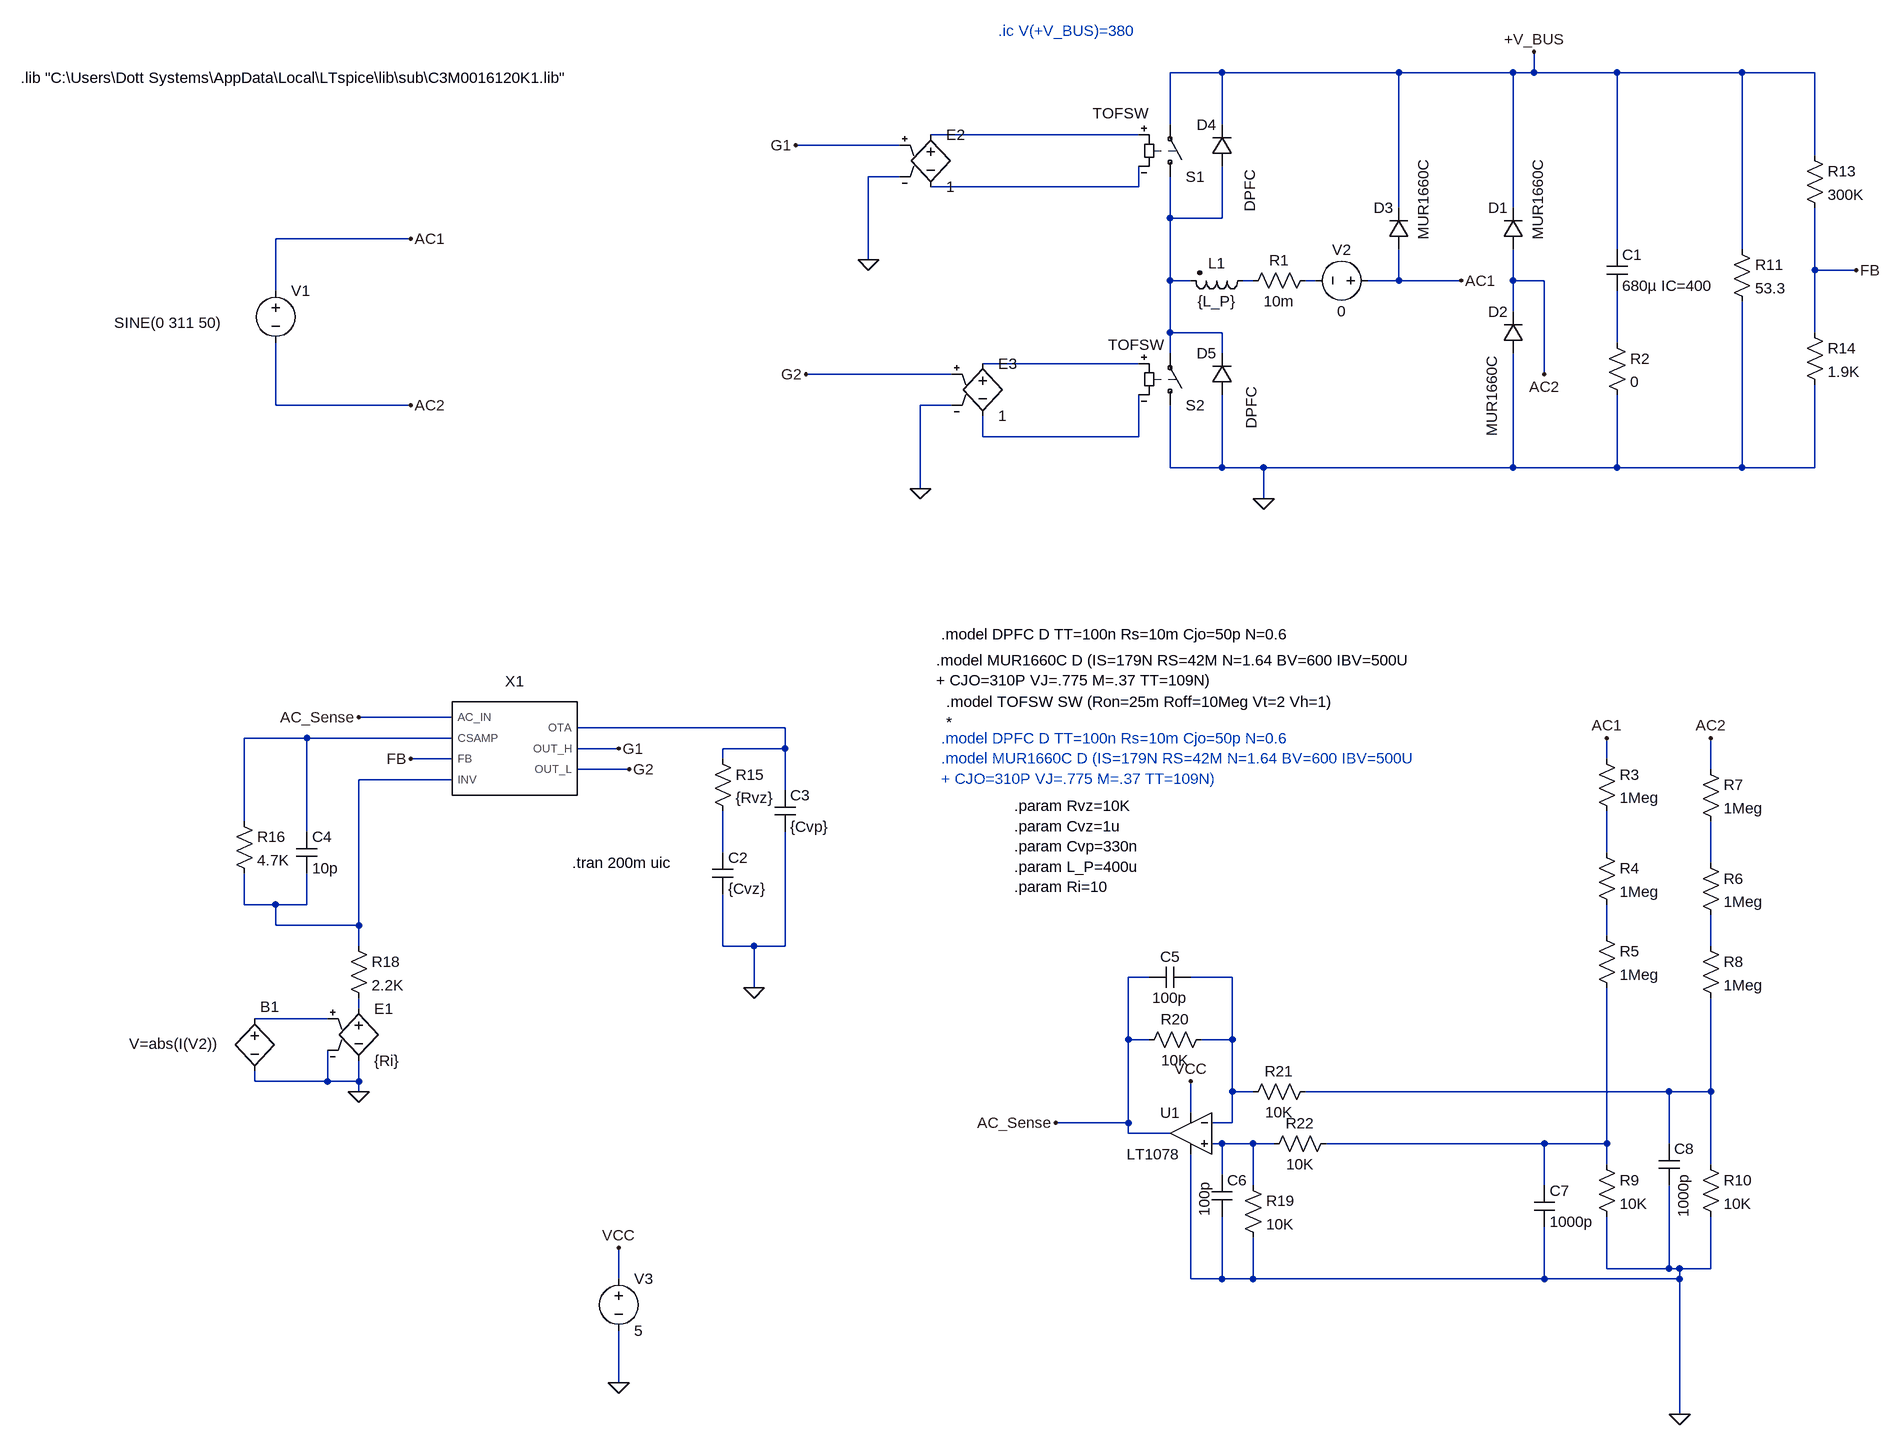
[diagram p0: schematic totempole_pfc.asc]
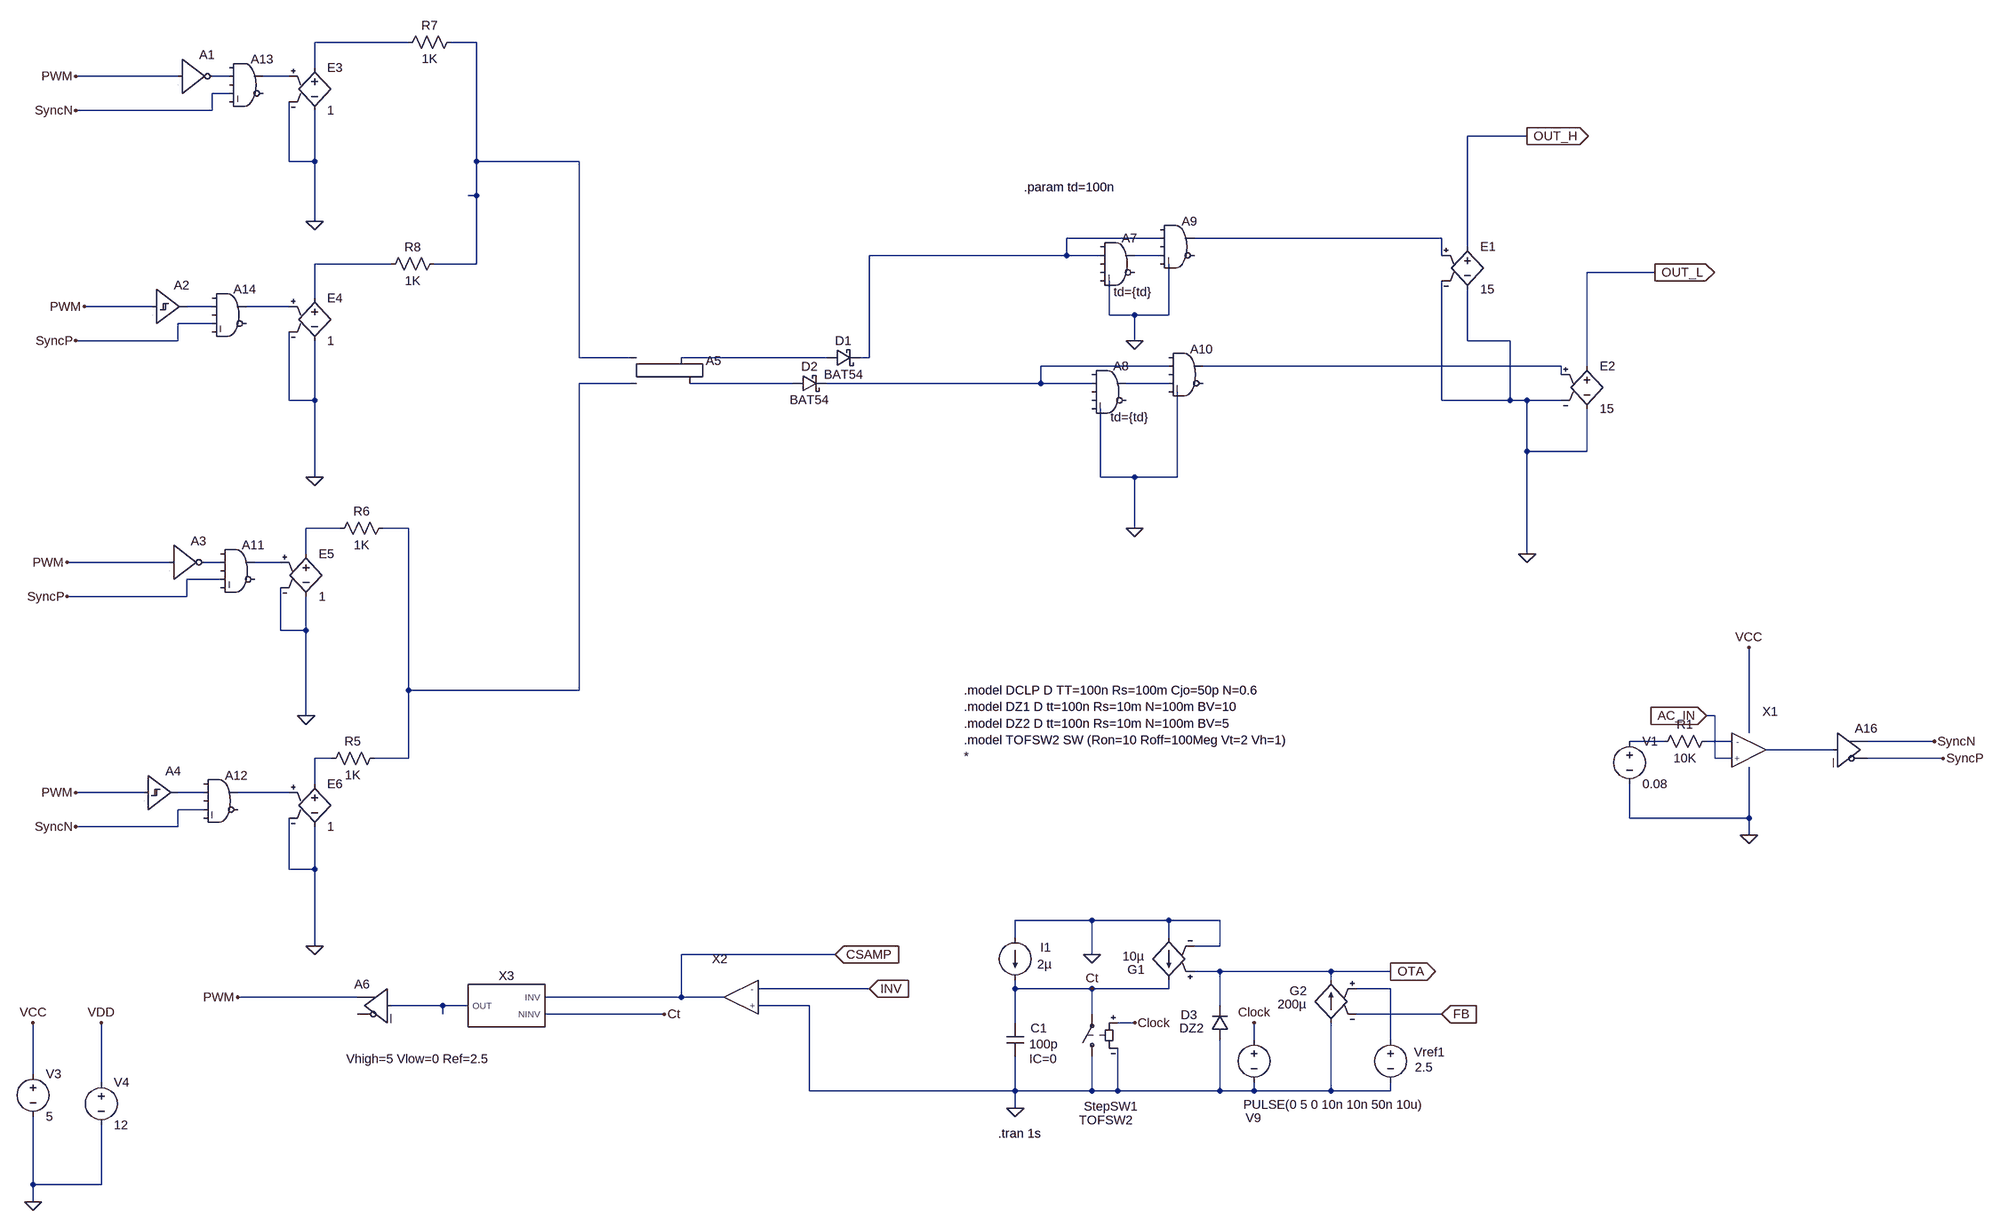
[diagram p1: sub-circuit drive.asc]
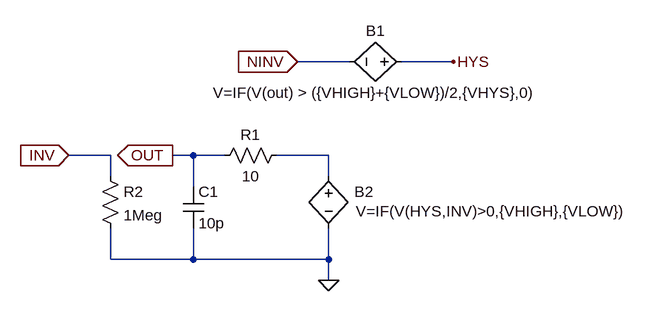
[diagram p2: sub-circuit ompamp.asc]
totempole_pfc.asc, the LTspice schematic file:
Version 4
SHEET 1 2784 2188
WIRE 976 -112 896 -112
WIRE 1248 -112 976 -112
WIRE 1424 -112 1248 -112
WIRE 1456 -112 1456 -144
WIRE 1456 -112 1424 -112
WIRE 1584 -112 1456 -112
WIRE 1776 -112 1584 -112
WIRE 1888 -112 1776 -112
WIRE 896 -32 896 -112
WIRE 976 -32 976 -112
WIRE 848 -16 528 -16
WIRE 480 0 320 0
WIRE 1888 16 1888 -112
WIRE 480 48 432 48
WIRE 848 64 848 32
WIRE 848 64 528 64
WIRE 1248 96 1248 -112
WIRE 1424 96 1424 -112
WIRE 896 112 896 48
WIRE 976 112 976 32
WIRE 976 112 896 112
WIRE -272 144 -480 144
WIRE 1584 160 1584 -112
WIRE 1776 160 1776 -112
WIRE 432 176 432 48
WIRE 1888 192 1888 96
WIRE 1952 192 1888 192
WIRE 896 208 896 112
WIRE 928 208 896 208
WIRE 1024 208 1008 208
WIRE 1120 208 1104 208
WIRE 1248 208 1248 160
WIRE 1248 208 1200 208
WIRE 1344 208 1248 208
WIRE 1424 208 1424 160
WIRE 1472 208 1424 208
WIRE -480 224 -480 144
WIRE 1424 256 1424 208
WIRE 896 288 896 208
WIRE 976 288 896 288
WIRE 1888 288 1888 192
WIRE 1584 304 1584 224
WIRE 896 320 896 288
WIRE 976 320 976 288
WIRE 848 336 608 336
WIRE 560 352 336 352
WIRE 1472 352 1472 208
WIRE -480 400 -480 304
WIRE -272 400 -480 400
WIRE 560 400 512 400
WIRE 608 448 608 416
WIRE 848 448 848 384
WIRE 848 448 608 448
WIRE 896 496 896 400
WIRE 976 496 976 384
WIRE 976 496 896 496
WIRE 1040 496 976 496
WIRE 1424 496 1424 320
WIRE 1424 496 1040 496
WIRE 1584 496 1584 384
WIRE 1584 496 1424 496
WIRE 1776 496 1776 240
WIRE 1776 496 1584 496
WIRE 1888 496 1888 368
WIRE 1888 496 1776 496
WIRE 512 528 512 400
WIRE 1040 544 1040 496
WIRE -208 880 -352 880
WIRE 304 896 -16 896
WIRE -432 912 -528 912
WIRE -208 912 -432 912
WIRE 48 928 -16 928
WIRE 304 928 304 896
WIRE 304 928 208 928
WIRE -208 944 -272 944
WIRE 208 944 208 928
WIRE 1568 944 1568 912
WIRE 64 960 -16 960
WIRE 1728 960 1728 912
WIRE -208 976 -352 976
WIRE 304 992 304 928
WIRE -528 1040 -528 912
WIRE -432 1056 -432 912
WIRE 208 1088 208 1024
WIRE 1568 1088 1568 1024
WIRE 1728 1104 1728 1040
WIRE -528 1168 -528 1120
WIRE -480 1168 -528 1168
WIRE -432 1168 -432 1120
WIRE -432 1168 -480 1168
WIRE -480 1200 -480 1168
WIRE -352 1200 -352 976
WIRE -352 1200 -480 1200
WIRE 1568 1216 1568 1168
WIRE -352 1232 -352 1200
WIRE 208 1232 208 1152
WIRE 256 1232 208 1232
WIRE 304 1232 304 1056
WIRE 304 1232 256 1232
WIRE 1728 1232 1728 1184
WIRE 864 1280 832 1280
WIRE 992 1280 928 1280
WIRE 256 1296 256 1232
WIRE -352 1328 -352 1312
WIRE -400 1344 -512 1344
WIRE 832 1376 832 1280
WIRE 864 1376 832 1376
WIRE 992 1376 992 1280
WIRE 992 1376 944 1376
WIRE -512 1440 -512 1424
WIRE -400 1440 -400 1392
WIRE -400 1440 -512 1440
WIRE -352 1440 -352 1408
WIRE -352 1440 -400 1440
WIRE -352 1456 -352 1440
WIRE 992 1456 992 1376
WIRE 1024 1456 992 1456
WIRE 1664 1456 1104 1456
WIRE 1728 1456 1728 1312
WIRE 1728 1456 1664 1456
WIRE 928 1488 928 1440
WIRE 832 1504 832 1376
WIRE 832 1504 720 1504
WIRE 992 1504 992 1456
WIRE 992 1504 960 1504
WIRE 832 1520 832 1504
WIRE 896 1520 832 1520
WIRE 976 1536 960 1536
WIRE 1024 1536 976 1536
WIRE 1056 1536 1024 1536
WIRE 1472 1536 1136 1536
WIRE 1568 1536 1568 1296
WIRE 1568 1536 1472 1536
WIRE 1664 1536 1664 1456
WIRE 1568 1568 1568 1536
WIRE 1728 1568 1728 1456
WIRE 976 1584 976 1536
WIRE 1024 1600 1024 1536
WIRE 1472 1600 1472 1536
WIRE 1568 1728 1568 1648
WIRE 1664 1728 1664 1600
WIRE 1664 1728 1568 1728
WIRE 1680 1728 1664 1728
WIRE 1728 1728 1728 1648
WIRE 1728 1728 1680 1728
WIRE 48 1744 48 1696
WIRE 928 1744 928 1552
WIRE 976 1744 976 1648
WIRE 976 1744 928 1744
WIRE 1024 1744 1024 1680
WIRE 1024 1744 976 1744
WIRE 1472 1744 1472 1664
WIRE 1472 1744 1024 1744
WIRE 1680 1744 1680 1728
WIRE 1680 1744 1472 1744
WIRE 48 1904 48 1824
WIRE 1680 1952 1680 1744
FLAG 1040 544 0
FLAG -272 144 AC1
FLAG -272 400 AC2
FLAG 1344 208 AC1
FLAG 1472 352 AC2
FLAG 1456 -144 +V_BUS
FLAG -352 880 AC_Sense
FLAG 48 928 G1
FLAG 64 960 G2
FLAG -272 944 FB
FLAG 256 1296 0
FLAG -352 1456 0
FLAG 1952 192 FB
FLAG 432 176 0
FLAG 512 528 0
FLAG 336 352 G2
FLAG 320 0 G1
FLAG 1568 912 AC1
FLAG 1728 912 AC2
FLAG 1680 1952 0
FLAG 720 1504 AC_Sense
FLAG 48 1696 VCC
FLAG 928 1440 VCC
FLAG 48 1904 0
SYMBOL voltage -480 208 R0
WINDOW 3 -248 65 Left 2
WINDOW 123 0 0 Left 0
WINDOW 39 0 0 Left 0
SYMATTR Value SINE(0 311 50)
SYMATTR InstName V1
SYMBOL ind2 1024 192 R90
WINDOW 0 5 56 VBottom 2
WINDOW 3 32 56 VTop 2
SYMATTR InstName L1
SYMATTR Value {L_P}
SYMATTR Type ind
SYMBOL res 1760 144 R0
SYMATTR InstName R11
SYMATTR Value 53.3
SYMBOL cap 1568 160 R0
SYMATTR InstName C1
SYMATTR Value 680µ IC=400
SYMATTR SpiceLine V=650
SYMBOL res 1872 0 R0
SYMATTR InstName R13
SYMATTR Value 300K
SYMBOL res 1872 272 R0
SYMATTR InstName R14
SYMATTR Value 1.9K
SYMBOL res 192 928 R0
SYMATTR InstName R15
SYMATTR Value {Rvz}
SYMBOL cap 192 1088 R0
SYMATTR InstName C2
SYMATTR Value {Cvz}
SYMBOL cap 288 992 R0
SYMATTR InstName C3
SYMATTR Value {Cvp}
SYMBOL res -544 1024 R0
SYMATTR InstName R16
SYMATTR Value 4.7K
SYMBOL cap -448 1056 R0
SYMATTR InstName C4
SYMATTR Value 10p
SYMBOL e -352 1312 R0
SYMATTR InstName E1
SYMATTR Value {Ri}
SYMBOL res -368 1216 R0
SYMATTR InstName R18
SYMATTR Value 2.2K
SYMBOL voltage 1216 208 R90
WINDOW 0 -32 56 VBottom 2
WINDOW 3 32 56 VTop 2
SYMATTR InstName V2
SYMATTR Value 0
SYMBOL bv -512 1328 R0
WINDOW 3 -193 54 Left 2
WINDOW 0 8 -3 Left 2
SYMATTR Value V=abs(I(V2))
SYMATTR InstName B1
SYMBOL diode 1440 160 R180
WINDOW 0 24 64 Left 2
WINDOW 3 -22 14 VRight 2
SYMATTR InstName D1
SYMATTR Value MUR1660C
SYMBOL diode 1440 320 R180
WINDOW 0 24 64 Left 2
WINDOW 3 49 -128 VRight 2
SYMATTR InstName D2
SYMATTR Value MUR1660C
SYMBOL res 1120 192 R90
WINDOW 0 0 56 VBottom 2
WINDOW 3 32 56 VTop 2
SYMATTR InstName R1
SYMATTR Value 10m
SYMBOL e 528 -32 R0
SYMATTR InstName E2
SYMATTR Value 1
SYMBOL e 608 320 R0
SYMATTR InstName E3
SYMATTR Value 1
SYMBOL res 1568 288 R0
SYMATTR InstName R2
SYMATTR Value 0
SYMBOL diode 1264 160 R180
WINDOW 0 24 64 Left 2
WINDOW 3 -22 14 VRight 2
SYMATTR InstName D3
SYMATTR Value MUR1660C
SYMBOL sw 896 64 M180
WINDOW 3 -119 113 Left 2
SYMATTR Value TOFSW
SYMATTR InstName S1
SYMBOL sw 896 416 M180
WINDOW 3 -95 109 Left 2
SYMATTR Value TOFSW
SYMATTR InstName S2
SYMBOL diode 992 32 R180
WINDOW 0 24 64 Left 2
WINDOW 3 -27 -71 VRight 2
SYMATTR InstName D4
SYMATTR Value DPFC
SYMBOL diode 992 384 R180
WINDOW 0 24 64 Left 2
WINDOW 3 -29 -53 VRight 2
SYMATTR InstName D5
SYMATTR Value DPFC
SYMBOL res 1552 928 R0
SYMATTR InstName R3
SYMATTR Value 1Meg
SYMBOL res 1552 1072 R0
SYMATTR InstName R4
SYMATTR Value 1Meg
SYMBOL res 1552 1200 R0
SYMATTR InstName R5
SYMATTR Value 1Meg
SYMBOL res 1712 1088 R0
SYMATTR InstName R6
SYMATTR Value 1Meg
SYMBOL res 1712 944 R0
SYMATTR InstName R7
SYMATTR Value 1Meg
SYMBOL res 1712 1216 R0
SYMATTR InstName R8
SYMATTR Value 1Meg
SYMBOL res 1552 1552 R0
SYMATTR InstName R9
SYMATTR Value 10K
SYMBOL res 1712 1552 R0
SYMATTR InstName R10
SYMATTR Value 10K
SYMBOL drive -112 928 R0
WINDOW 0 0 -88 Bottom 2
SYMATTR InstName X1
SYMBOL OpAmps\\LT1078 928 1456 M0
SYMATTR InstName U1
SYMBOL res 960 1360 R90
WINDOW 0 0 56 VBottom 2
WINDOW 3 32 56 VTop 2
SYMATTR InstName R20
SYMATTR Value 10K
SYMBOL voltage 48 1728 R0
WINDOW 123 0 0 Left 0
WINDOW 39 0 0 Left 0
SYMATTR InstName V3
SYMATTR Value 5
SYMBOL cap 928 1264 R90
WINDOW 0 0 32 VBottom 2
WINDOW 3 32 32 VTop 2
SYMATTR InstName C5
SYMATTR Value 100p
SYMBOL res 1008 1584 R0
SYMATTR InstName R19
SYMATTR Value 10K
SYMBOL res 1120 1440 R90
WINDOW 0 0 56 VBottom 2
WINDOW 3 32 56 VTop 2
SYMATTR InstName R21
SYMATTR Value 10K
SYMBOL res 1152 1520 R90
WINDOW 0 0 56 VBottom 2
WINDOW 3 32 56 VTop 2
SYMATTR InstName R22
SYMATTR Value 10K
SYMBOL cap 960 1584 R0
WINDOW 3 -11 10 VRight 2
SYMATTR Value 100p
SYMATTR InstName C6
SYMBOL cap 1456 1600 R0
SYMATTR InstName C7
SYMATTR Value 1000p
SYMBOL cap 1648 1536 R0
WINDOW 3 38 46 VRight 2
SYMATTR InstName C8
SYMATTR Value 1000p
TEXT -24 1104 Left 2 !.tran 200m uic
TEXT 656 1016 Left 2 !.param Rvz=10K\n.param Cvz=1u\n.param Cvp=330n\n.param L_P=400u\n.param Ri=10
TEXT 552 856 Left 2 !.model TOFSW SW (Ron=25m Roff=10Meg Vt=2 Vh=1)\n*
TEXT 544 912 Left 2 ;.model DPFC D TT=100n Rs=10m Cjo=50p N=0.6\n.model MUR1660C D (IS=179N RS=42M N=1.64 BV=600 IBV=500U\n+ CJO=310P VJ=.775 M=.37 TT=109N)
TEXT 632 -176 Left 2 ;.ic V(+V_BUS)=380
TEXT -872 -104 Left 2 !.lib "C:\\Users\\Dott Systems\\AppData\\Local\\LTspice\\lib\\sub\\C3M0016120K1.lib"
TEXT 536 792 Left 2 !.model MUR1660C D (IS=179N RS=42M N=1.64 BV=600 IBV=500U\n+ CJO=310P VJ=.775 M=.37 TT=109N)
TEXT 544 752 Left 2 !.model DPFC D TT=100n Rs=10m Cjo=50p N=0.6

drive.asc, the sub-circuit schematic file:
Version 4
SHEET 1 3092 1588
WIRE -640 -608 -816 -608
WIRE -512 -608 -560 -608
WIRE -816 -560 -816 -608
WIRE -1072 -544 -1264 -544
WIRE -976 -544 -1008 -544
WIRE -864 -544 -912 -544
WIRE -976 -512 -1008 -512
WIRE -1008 -480 -1008 -512
WIRE -1008 -480 -1264 -480
WIRE 1488 -432 1376 -432
WIRE -864 -384 -864 -496
WIRE -816 -384 -816 -480
WIRE -816 -384 -864 -384
WIRE -512 -384 -512 -608
WIRE -320 -384 -512 -384
WIRE -512 -320 -512 -384
WIRE -512 -320 -528 -320
WIRE -816 -272 -816 -384
WIRE 800 -240 624 -240
WIRE 1328 -240 864 -240
WIRE 1376 -224 1376 -432
WIRE 624 -208 624 -240
WIRE 624 -208 224 -208
WIRE 688 -208 624 -208
WIRE 800 -208 752 -208
WIRE 1328 -208 1328 -240
WIRE -672 -192 -816 -192
WIRE -512 -192 -512 -320
WIRE -512 -192 -592 -192
WIRE 1728 -176 1600 -176
WIRE -816 -128 -816 -192
WIRE -1120 -112 -1248 -112
WIRE -1008 -112 -1056 -112
WIRE -864 -112 -944 -112
WIRE 704 -96 704 -160
WIRE 752 -96 704 -96
WIRE 816 -96 816 -192
WIRE 816 -96 752 -96
WIRE -1008 -80 -1072 -80
WIRE -1072 -48 -1072 -80
WIRE -1072 -48 -1264 -48
WIRE 752 -48 752 -96
WIRE 1376 -48 1376 -144
WIRE 1456 -48 1376 -48
WIRE -320 -16 -320 -384
WIRE -224 -16 -320 -16
WIRE 144 -16 -128 -16
WIRE 224 -16 224 -208
WIRE 224 -16 208 -16
WIRE 816 0 576 0
WIRE 1552 0 880 0
WIRE 1600 0 1600 -176
WIRE 1552 16 1552 0
WIRE -224 32 -320 32
WIRE 80 32 -112 32
WIRE 576 32 576 0
WIRE 576 32 144 32
WIRE 672 32 576 32
WIRE 816 32 736 32
WIRE -864 64 -864 -64
WIRE -816 64 -816 -48
WIRE -816 64 -864 64
WIRE 1328 64 1328 -160
WIRE 1456 64 1456 -48
WIRE 1456 64 1328 64
WIRE 1488 64 1456 64
WIRE 1552 64 1488 64
WIRE 1488 160 1488 64
WIRE 1600 160 1600 80
WIRE 1600 160 1488 160
WIRE -816 208 -816 64
WIRE 688 208 688 80
WIRE 752 208 688 208
WIRE 832 208 832 48
WIRE 832 208 752 208
WIRE -768 304 -832 304
WIRE -640 304 -688 304
WIRE 752 304 752 208
WIRE -832 352 -832 304
WIRE 1488 352 1488 160
WIRE -1088 368 -1280 368
WIRE -992 368 -1024 368
WIRE -880 368 -928 368
WIRE -992 400 -1056 400
WIRE -1056 432 -1056 400
WIRE -1056 432 -1280 432
WIRE -880 496 -880 416
WIRE -832 496 -832 432
WIRE -832 496 -880 496
WIRE -640 608 -640 304
WIRE -320 608 -320 32
WIRE -320 608 -640 608
WIRE -832 656 -832 496
WIRE 1840 656 1824 656
WIRE 1904 688 1904 528
WIRE 1744 704 1680 704
WIRE 1872 704 1824 704
WIRE 2272 704 2128 704
WIRE 2064 720 1936 720
WIRE -784 736 -816 736
WIRE -640 736 -640 608
WIRE -640 736 -704 736
WIRE 1840 736 1840 656
WIRE 1872 736 1840 736
WIRE 2288 736 2128 736
WIRE -816 784 -816 736
WIRE -1136 800 -1264 800
WIRE -1024 800 -1072 800
WIRE -864 800 -960 800
WIRE -1024 832 -1072 832
WIRE 1680 848 1680 784
WIRE 1904 848 1904 752
WIRE 1904 848 1680 848
WIRE -1072 864 -1072 832
WIRE -1072 864 -1264 864
WIRE 1904 880 1904 848
WIRE -864 944 -864 848
WIRE -816 944 -816 864
WIRE -816 944 -864 944
WIRE 672 1040 528 1040
WIRE 816 1040 672 1040
WIRE 912 1040 816 1040
WIRE 528 1072 528 1040
WIRE 816 1072 816 1040
WIRE -816 1088 -816 944
WIRE 912 1088 912 1040
WIRE 912 1088 864 1088
WIRE 160 1104 -128 1104
WIRE 672 1104 672 1040
WIRE 912 1136 864 1136
WIRE 1120 1136 912 1136
WIRE 1232 1136 1120 1136
WIRE 1120 1152 1120 1136
WIRE 224 1168 16 1168
WIRE 528 1168 528 1152
WIRE 672 1168 528 1168
WIRE 816 1168 816 1152
WIRE 816 1168 672 1168
WIRE 1232 1168 1168 1168
WIRE -736 1184 -960 1184
WIRE -128 1184 -128 1104
WIRE -128 1184 -384 1184
WIRE -48 1184 -128 1184
WIRE -576 1200 -672 1200
WIRE -528 1200 -576 1200
WIRE 112 1200 16 1200
WIRE 912 1200 912 1136
WIRE -576 1216 -576 1200
WIRE -160 1216 -384 1216
WIRE 672 1216 672 1168
WIRE 1328 1216 1168 1216
WIRE 528 1232 528 1168
WIRE 752 1232 720 1232
WIRE 976 1264 976 1232
WIRE 1232 1264 1232 1168
WIRE -1344 1328 -1344 1232
WIRE -1216 1344 -1216 1232
WIRE 112 1360 112 1200
WIRE 528 1360 528 1296
WIRE 528 1360 112 1360
WIRE 672 1360 672 1296
WIRE 672 1360 528 1360
WIRE 720 1360 720 1280
WIRE 720 1360 672 1360
WIRE 912 1360 912 1264
WIRE 912 1360 720 1360
WIRE 976 1360 976 1344
WIRE 976 1360 912 1360
WIRE 1120 1360 1120 1232
WIRE 1120 1360 976 1360
WIRE 1232 1360 1232 1344
WIRE 1232 1360 1120 1360
WIRE 528 1392 528 1360
WIRE -1344 1536 -1344 1408
WIRE -1216 1536 -1216 1424
WIRE -1216 1536 -1344 1536
WIRE -1344 1568 -1344 1536
FLAG -1344 1568 0
FLAG -1344 1232 VCC
FLAG -1216 1232 VDD
FLAG -1248 -112 PWM
FLAG -1264 -544 PWM
FLAG -816 -272 0
FLAG -1264 800 PWM
FLAG -1280 368 PWM
FLAG -816 208 0
FLAG -832 656 0
FLAG -816 1088 0
FLAG 1488 352 0
FLAG 1824 656 AC_IN
IOPIN 1824 656 In
FLAG 1488 -432 OUT_H
IOPIN 1488 -432 Out
FLAG 1728 -176 OUT_L
IOPIN 1728 -176 Out
FLAG 672 1104 0
FLAG 672 1168 Ct
FLAG 528 1392 0
FLAG 1328 1216 FB
IOPIN 1328 1216 In
FLAG 1232 1136 OTA
IOPIN 1232 1136 Out
FLAG 752 1232 Clock
FLAG 976 1232 Clock
FLAG 224 1168 INV
IOPIN 224 1168 In
FLAG 160 1104 CSAMP
IOPIN 160 1104 In
FLAG -960 1184 PWM
FLAG -160 1216 Ct
FLAG 752 -48 0
FLAG 752 304 0
FLAG -1280 432 SyncP
FLAG -1264 864 SyncN
FLAG -1264 -48 SyncP
FLAG -1264 -480 SyncN
FLAG 2272 704 SyncN
FLAG 1904 880 0
FLAG 1904 528 VCC
FLAG 2288 736 SyncP
SYMBOL voltage -1344 1312 R0
WINDOW 123 0 0 Left 0
WINDOW 39 0 0 Left 0
SYMATTR InstName V3
SYMATTR Value 5
SYMBOL voltage -1216 1328 R0
WINDOW 123 0 0 Left 0
WINDOW 39 0 0 Left 0
SYMATTR InstName V4
SYMATTR Value 12
SYMBOL Digital\\inv -1072 -608 R0
SYMATTR InstName A1
SYMBOL Digital\\schmtbuf -1120 -176 R0
SYMATTR InstName A2
SYMBOL Digital\\inv -1088 304 R0
SYMATTR InstName A3
SYMBOL Digital\\schmtbuf -1136 736 R0
SYMATTR InstName A4
SYMBOL schottky 144 -32 M90
WINDOW 0 0 32 VBottom 2
WINDOW 3 32 32 VTop 2
SYMATTR InstName D1
SYMATTR Value BAT54
SYMATTR Description Diode
SYMATTR Type diode
SYMBOL schottky 80 16 M90
WINDOW 0 0 32 VBottom 2
WINDOW 3 32 32 VTop 2
SYMATTR InstName D2
SYMATTR Value BAT54
SYMATTR Description Diode
SYMATTR Type diode
SYMBOL Digital\\srflop -176 -64 R0
SYMATTR InstName A5
SYMBOL e 1376 -240 R0
SYMATTR InstName E1
SYMATTR Value 15
SYMBOL e 1600 -16 R0
SYMATTR InstName E2
SYMATTR Value 15
SYMBOL current 528 1072 R0
WINDOW 0 47 19 Left 2
WINDOW 3 41 50 Left 2
WINDOW 123 0 0 Left 0
WINDOW 39 0 0 Left 0
SYMATTR InstName I1
SYMATTR Value 2µ
SYMBOL cap 512 1232 R0
WINDOW 0 45 10 Left 2
WINDOW 3 42 40 Left 2
WINDOW 123 42 68 Left 2
SYMATTR InstName C1
SYMATTR Value 100p
SYMATTR Value2 IC=0
SYMBOL sw 672 1312 R180
WINDOW 3 -76 -103 Left 2
WINDOW 0 -86 -77 Left 2
SYMATTR Value TOFSW2
SYMATTR InstName StepSW1
SYMBOL g 816 1168 R180
WINDOW 0 45 36 Left 2
WINDOW 3 46 61 Left 2
SYMATTR InstName G1
SYMATTR Value 10µ
SYMBOL diode 928 1264 R180
WINDOW 0 59 47 Left 2
WINDOW 3 46 22 Left 2
SYMATTR InstName D3
SYMATTR Value DZ2
SYMBOL g 1120 1136 M0
WINDOW 0 45 36 Left 2
WINDOW 3 46 61 Left 2
SYMATTR InstName G2
SYMATTR Value 200µ
SYMBOL voltage 1232 1248 R0
WINDOW 0 44 39 Left 2
WINDOW 3 46 68 Left 2
SYMATTR InstName Vref1
SYMATTR Value 2.5
SYMBOL voltage 976 1248 R0
WINDOW 0 -16 163 Left 2
WINDOW 3 -20 138 Left 2
WINDOW 123 0 0 Left 0
WINDOW 39 0 0 Left 0
SYMATTR InstName V9
SYMATTR Value PULSE(0 5 0 10n 10n 50n 10u)
SYMBOL Digital\\buf -672 1136 M0
WINDOW 39 -183 164 Left 2
SYMATTR SpiceLine Vhigh=5 Vlow=0 Ref=2.5
SYMATTR InstName A6
SYMBOL Digital\\and 720 -256 R0
WINDOW 3 -7 117 Left 2
SYMATTR Value td={td}
SYMATTR InstName A7
SYMBOL Digital\\and 704 -16 R0
WINDOW 3 3 112 Left 2
SYMATTR Value td={td}
SYMATTR InstName A8
SYMBOL Digital\\and 832 -288 R0
WINDOW 3 -7 117 Left 2
SYMATTR InstName A9
SYMBOL Digital\\and 848 -48 R0
WINDOW 3 -7 117 Left 2
SYMATTR InstName A10
SYMBOL e -816 -576 R0
SYMATTR InstName E3
SYMATTR Value 1
SYMBOL e -816 -144 R0
SYMATTR InstName E4
SYMATTR Value 1
SYMBOL e -832 336 R0
SYMATTR InstName E5
SYMATTR Value 1
SYMBOL e -816 768 R0
SYMATTR InstName E6
SYMATTR Value 1
SYMBOL res -688 720 R90
WINDOW 0 0 56 VBottom 2
WINDOW 3 32 56 VTop 2
SYMATTR InstName R5
SYMATTR Value 1K
SYMBOL res -672 288 R90
WINDOW 0 0 56 VBottom 2
WINDOW 3 32 56 VTop 2
SYMATTR InstName R6
SYMATTR Value 1K
SYMBOL res -544 -624 R90
WINDOW 0 0 56 VBottom 2
WINDOW 3 32 56 VTop 2
SYMATTR InstName R7
SYMATTR Value 1K
SYMBOL res -576 -208 R90
WINDOW 0 0 56 VBottom 2
WINDOW 3 32 56 VTop 2
SYMATTR InstName R8
SYMATTR Value 1K
SYMBOL Digital\\and -944 -592 R0
SYMATTR InstName A13
SYMBOL Digital\\and -976 -160 R0
SYMATTR InstName A14
SYMBOL Digital\\and -960 320 R0
SYMATTR InstName A11
SYMBOL Digital\\and -992 752 R0
SYMATTR InstName A12
SYMBOL opamptof -48 1168 M0
SYMATTR InstName X2
SYMATTR SpiceLine Vlow=100m Vhigh=5
SYMBOL Ompamp -448 1200 M0
SYMATTR InstName X3
SYMATTR SpiceLine VHIGH=5 VLOW=100m VHYS=10m
SYMBOL voltage 1680 688 R0
WINDOW 123 0 0 Left 0
WINDOW 39 0 0 Left 0
SYMATTR InstName V1
SYMATTR Value 0.08
SYMBOL res 1840 688 R90
WINDOW 0 0 56 VBottom 2
WINDOW 3 32 56 VTop 2
SYMATTR InstName R1
SYMATTR Value 10K
SYMBOL opamptof 1936 704 R0
SYMATTR InstName X1
SYMATTR SpiceLine Vlow=100m Vhigh=5
SYMBOL Digital\\buf 2064 656 R0
SYMATTR InstName A16
TEXT 496 1440 Left 2 !.tran 1s
TEXT 432 608 Left 2 !.model DCLP D TT=100n Rs=100m Cjo=50p N=0.6\n.model DZ1 D tt=100n Rs=10m N=100m BV=10\n.model DZ2 D tt=100n Rs=10m N=100m BV=5\n.model TOFSW2 SW (Ron=10 Roff=100Meg Vt=2 Vh=1)\n*
TEXT 544 -336 Left 2 !.param td=100n

ompamp.asc, the sub-circuit schematic file:
Version 4
SHEET 1 1152 680
WIRE 672 -144 592 -144
WIRE 832 -144 752 -144
WIRE 304 0 240 0
WIRE 432 0 400 0
WIRE 480 0 432 0
WIRE 640 0 560 0
WIRE 304 32 304 0
WIRE 640 32 640 0
WIRE 432 48 432 0
WIRE 304 160 304 112
WIRE 432 160 432 112
WIRE 432 160 304 160
WIRE 640 160 640 112
WIRE 640 160 432 160
WIRE 640 192 640 160
FLAG 592 -144 NINV
IOPIN 592 -144 In
FLAG 832 -144 HYS
FLAG 640 192 0
FLAG 400 0 OUT
IOPIN 400 0 Out
FLAG 240 0 INV
IOPIN 240 0 In
SYMBOL bv 768 -144 R90
WINDOW 0 -32 56 VBottom 2
WINDOW 3 32 56 VTop 2
SYMATTR InstName B1
SYMATTR Value V=IF(V(out) > ({VHIGH}+{VLOW})/2,{VHYS},0)
SYMBOL bv 640 16 R0
WINDOW 0 40 40 Left 2
WINDOW 3 42 70 Left 2
SYMATTR InstName B2
SYMATTR Value V=IF(V(HYS,INV)>0,{VHIGH},{VLOW})
SYMBOL res 576 -16 R90
WINDOW 0 0 56 VBottom 2
WINDOW 3 32 56 VTop 2
SYMATTR InstName R1
SYMATTR Value 10
SYMBOL cap 416 48 R0
SYMATTR InstName C1
SYMATTR Value 10p
SYMBOL res 288 16 R0
SYMATTR InstName R2
SYMATTR Value 1Meg

The netlist it stands for:
* totempole_pfc.asc
V1 AC1 AC2 SINE(0 311 50)
L1 N004 N003 {L_P}
R11 +V_BUS 0 53.3
C1 +V_BUS N006 680µ IC=400 V=650
R13 +V_BUS FB 300K
R14 FB 0 1.9K
R15 N009 N012 {Rvz}
C2 N012 0 {Cvz}
C3 N009 0 {Cvp}
R16 N010 N011 4.7K
C4 N010 N011 10p
E1 N018 0 N019 0 {Ri}
R18 N011 N018 2.2K
V2 AC1 N005 0
B1 N019 0 V=abs(I(V2))
D1 AC2 +V_BUS MUR1660C
D2 0 AC2 MUR1660C
R1 N005 N004 10m
E2 N001 N002 G1 0 1
E3 N007 N008 G2 0 1
R2 N006 0 0
D3 AC1 +V_BUS MUR1660C
S1 N003 +V_BUS N001 N002 TOFSW
S2 0 N003 N007 N008 TOFSW
D4 N003 +V_BUS DPFC
D5 0 N003 DPFC
R3 AC1 N013 1Meg
R4 N013 N015 1Meg
R5 N015 N022 1Meg
R6 N014 N016 1Meg
R7 AC2 N014 1Meg
R8 N016 N020 1Meg
R9 N022 0 10K
R10 N020 0 10K
XX1 AC_Sense N010 FB N011 N009 G1 G2 drive
XU1 N021 N017 VCC 0 AC_Sense LT1078  ; pins In+ In- V+ V- OUT
R20 N017 AC_Sense 10K
V3 VCC 0 5
C5 N017 AC_Sense 100p
R19 N021 0 10K
R21 N020 N017 10K
R22 N022 N021 10K
C6 N021 0 100p
C7 N022 0 1000p
C8 N020 0 1000p

* block symbol definitions
.subckt drive AC_IN CSAMP FB INV OTA OUT_H OUT_L
V3 VCC 0 5
V4 VDD 0 12
A1 PWM 0 0 0 0 N003 0 0 BUF
A2 PWM 0 0 0 0 0 N009 0 SCHMITT
A3 PWM 0 0 0 0 N018 0 0 BUF
A4 PWM 0 0 0 0 0 N024 0 SCHMITT
D1 N011 N005 BAT54
D2 N015 N012 BAT54
A5 N002 N014 0 0 0 N015 N011 0 SRFLOP
E1 OUT_H 0 N006 0 15
E2 OUT_L 0 N013 0 15
I1 0 Ct 2µ
C1 Ct 0 100p IC=0
StepSW1 0 Ct Clock 0 TOFSW2
G1 0 Ct OTA 0 10µ
D3 0 OTA DZ2
G2 0 OTA N026 FB 200µ
Vref1 N026 0 2.5
V9 Clock 0 PULSE(0 5 0 10n 10n 50n 10u)
A6 N027 0 0 0 0 0 PWM 0 BUF Vhigh=5 Vlow=0 Ref=2.5
A7 0 N005 0 0 0 0 N007 0 AND td={td}
A8 0 N012 0 0 0 0 N016 0 AND td={td}
A9 0 N005 0 N007 0 0 N006 0 AND
A10 0 N012 0 N016 0 0 N013 0 AND
E3 N001 0 N004 0 1
E4 N008 0 N010 0 1
E5 N017 0 N019 0 1
E6 N023 0 N025 0 1
R5 N014 N023 1K
R6 N014 N017 1K
R7 N002 N001 1K
R8 N002 N008 1K
A13 0 N003 0 SyncN 0 0 N004 0 AND
A14 0 N009 0 SyncP 0 0 N010 0 AND
A11 0 N018 0 SyncP 0 0 N019 0 AND
A12 0 N024 0 SyncN 0 0 N025 0 AND
XX2 INV 0 CSAMP opamptof params: Vlow=100m Vhigh=5  ; pins - + OUT
XX3 CSAMP Ct N027 ompamp params: VHIGH=5 VLOW=100m VHYS=10m
V1 N020 0 0.08
R1 N021 N020 10K
XX1 N021 AC_IN N022 opamptof params: Vlow=100m Vhigh=5  ; pins - + OUT
A16 N022 0 0 0 0 SyncP SyncN 0 BUF
.tran 1s
.model DCLP D TT=100n Rs=100m Cjo=50p N=0.6
.model DZ1 D tt=100n Rs=10m N=100m BV=10
.model DZ2 D tt=100n Rs=10m N=100m BV=5
.model TOFSW2 SW (Ron=10 Roff=100Meg Vt=2 Vh=1)
*
.param td=100n
.ends drive

.subckt ompamp INV NINV OUT
B1 HYS NINV V=IF(V(out) > ({VHIGH}+{VLOW})/2,{VHYS},0)
B2 N001 0 V=IF(V(HYS,INV)>0,{VHIGH},{VLOW})
R1 N001 OUT 10
C1 OUT 0 10p
R2 INV 0 1Meg
.ends ompamp

.model D D
.lib standard.dio
.tran 200m uic
.param Rvz=10K
.param Cvz=1u
.param Cvp=330n
.param L_P=400u
.param Ri=10
.model TOFSW SW (Ron=25m Roff=10Meg Vt=2 Vh=1)
*
* .model DPFC D TT=100n Rs=10m Cjo=50p N=0.6
* .model MUR1660C D (IS=179N RS=42M N=1.64 BV=600 IBV=500U
* + CJO=310P VJ=.775 M=.37 TT=109N)
* .ic V(+V_BUS)=380
.lib "C:\Users\Dott Systems\AppData\Local\LTspice\lib\sub\C3M0016120K1.lib"
.model MUR1660C D (IS=179N RS=42M N=1.64 BV=600 IBV=500U
+ CJO=310P VJ=.775 M=.37 TT=109N)
.model DPFC D TT=100n Rs=10m Cjo=50p N=0.6
.backanno
.end